# Altium schematic sheet bmsMaster_hvpath.SchDoc
size B; SheetNumber: 5; SheetTotal: 9
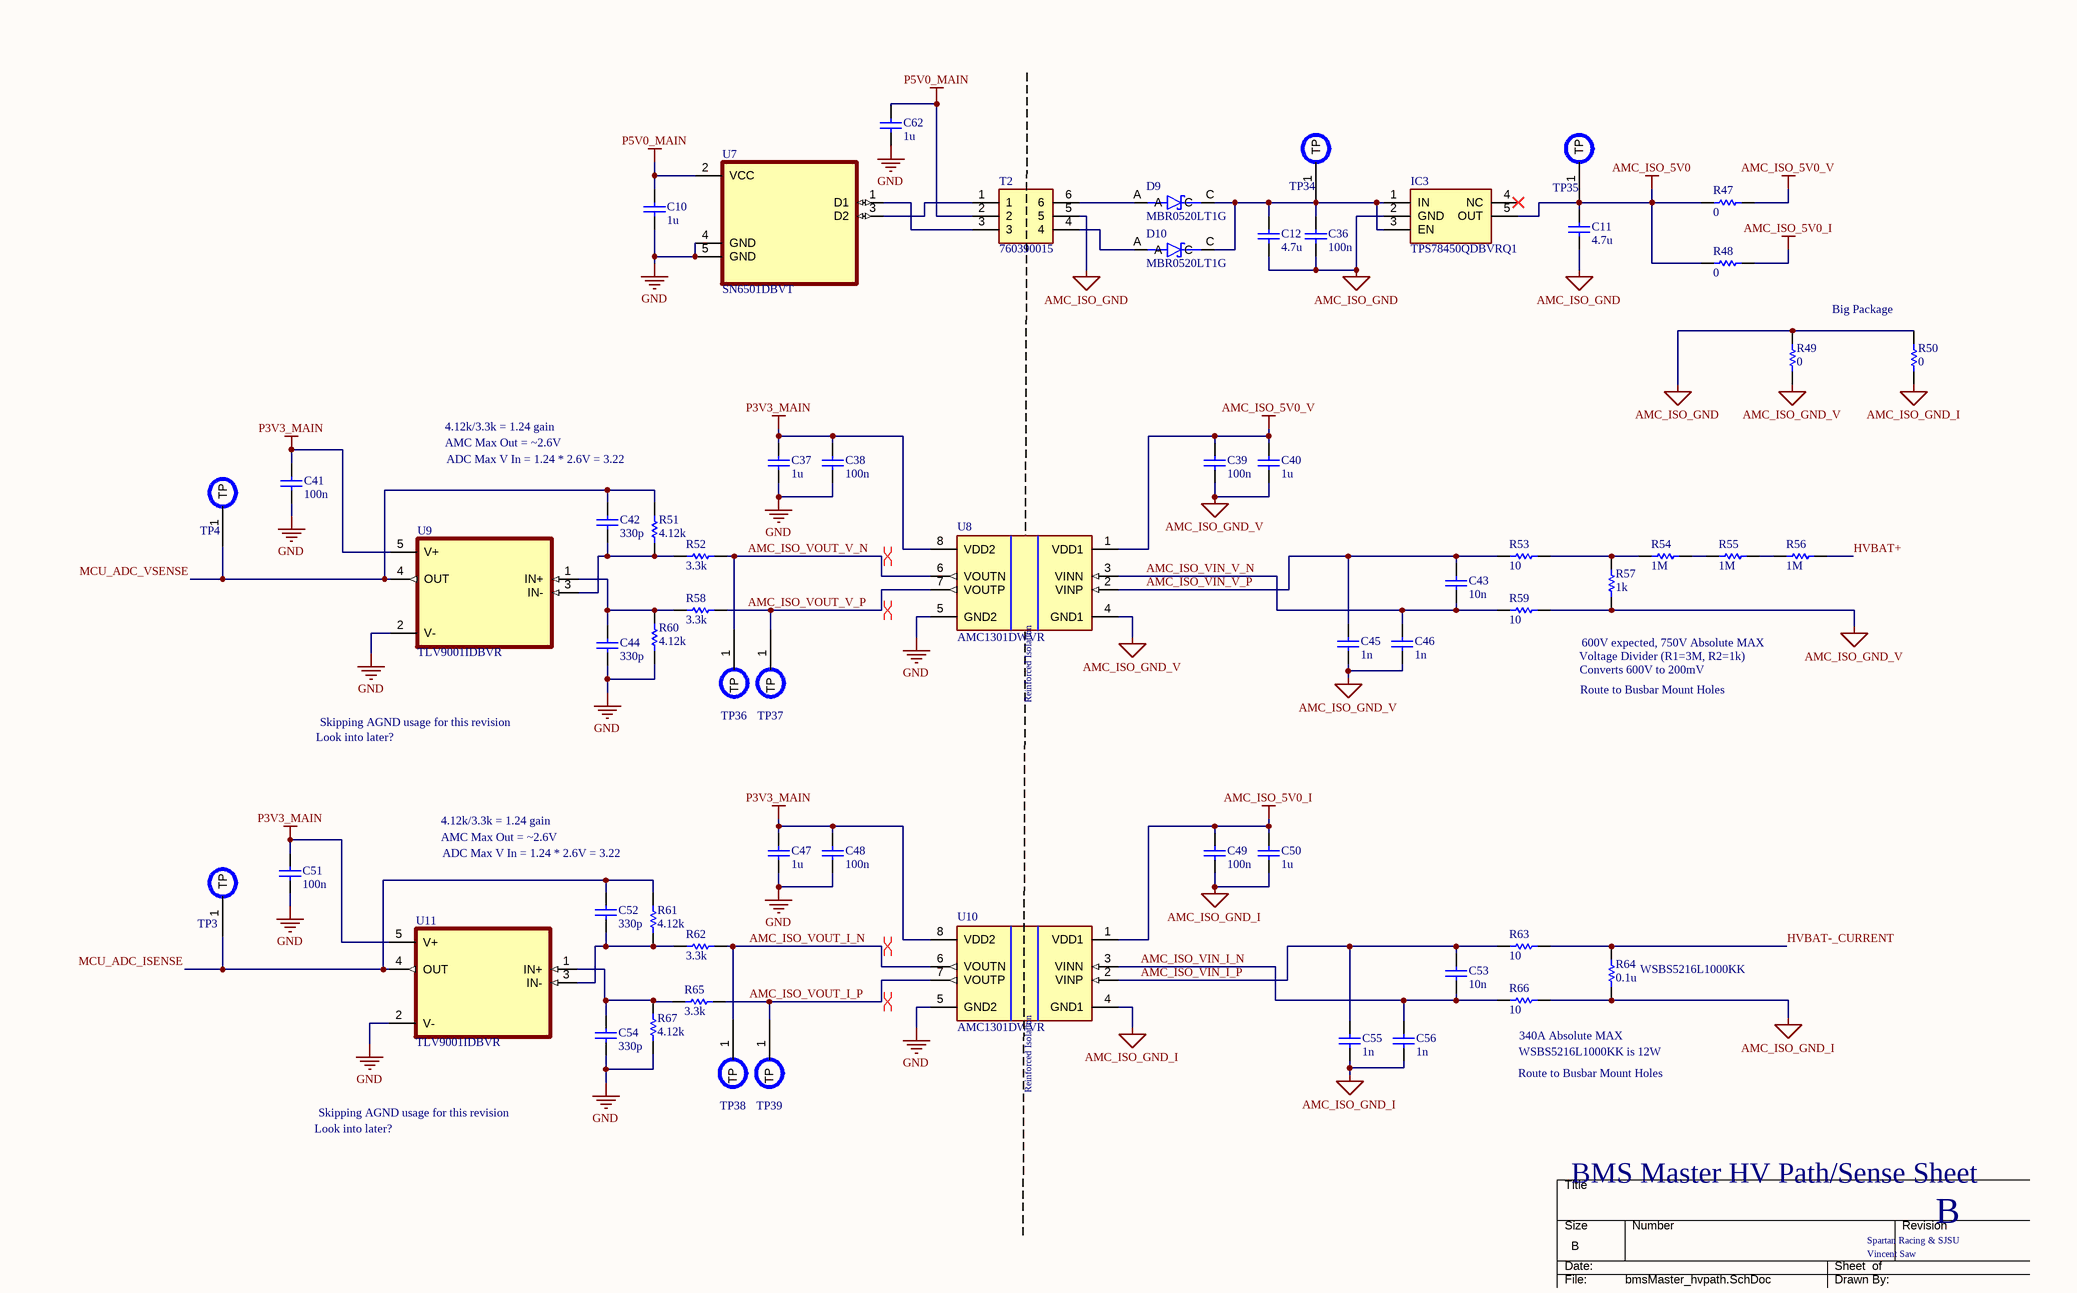
[diagram p0: bmsMaster_hvpath.SchDoc]

## Parts
C10  value 1u  [CAPC1608X90N]  (hidden comment: Capacitor)
C11  value 4.7u  [CAPC1608X90N]  (hidden comment: Capacitor)
C12  value 4.7u  [CAPC1608X90N]  (hidden comment: Capacitor)
C36  value 100n  [CAPC1608X90N]  (hidden comment: Capacitor)
C37  value 1u  [CAPC1608X90N]  (hidden comment: Capacitor)
C38  value 100n  [CAPC1608X90N]  (hidden comment: Capacitor)
C39  value 100n  [CAPC1608X90N]  (hidden comment: Capacitor)
C40  value 1u  [CAPC1608X90N]  (hidden comment: Capacitor)
C41  value 100n  [CAPC1608X90N]  (hidden comment: Capacitor)
C42  value 330p  [CAPC1608X90N]  (hidden comment: Capacitor)
C43  value 10n  [CAPC1608X90N]  (hidden comment: Capacitor)
C44  value 330p  [CAPC1608X90N]  (hidden comment: Capacitor)
C45  value 1n  [CAPC1608X90N]  (hidden comment: Capacitor)
C46  value 1n  [CAPC1608X90N]  (hidden comment: Capacitor)
C47  value 1u  [CAPC1608X90N]  (hidden comment: Capacitor)
C48  value 100n  [CAPC1608X90N]  (hidden comment: Capacitor)
C49  value 100n  [CAPC1608X90N]  (hidden comment: Capacitor)
C50  value 1u  [CAPC1608X90N]  (hidden comment: Capacitor)
C51  value 100n  [CAPC1608X90N]  (hidden comment: Capacitor)
C52  value 330p  [CAPC1608X90N]  (hidden comment: Capacitor)
C53  value 10n  [CAPC1608X90N]  (hidden comment: Capacitor)
C54  value 330p  [CAPC1608X90N]  (hidden comment: Capacitor)
C55  value 1n  [CAPC1608X90N]  (hidden comment: Capacitor)
C56  value 1n  [CAPC1608X90N]  (hidden comment: Capacitor)
C62  value 1u  [CAPC1608X90N]  (hidden comment: Capacitor)
D9  MBR0520LT1G  [SOD3716X135N]
D10  MBR0520LT1G  [SOD3716X135N]
IC3  TPS78450QDBVRQ1  [SOT95P280X145-5N]
R47  value 0  [RESC1608X50N]  (hidden comment: Resistor)
R48  value 0  [RESC1608X50N]  (hidden comment: Resistor)
R49  value 0  [RESC1608X50N]  (hidden comment: Resistor)
R50  value 0  [RESC1608X50N]  (hidden comment: Resistor)
R51  value 4.12k  [RESC1608X50N]  (hidden comment: Resistor)
R52  value 3.3k  [RESC1608X50N]  (hidden comment: Resistor)
R53  value 10  [RESC1608X50N]  (hidden comment: Resistor)
R54  value 1M  [RESC1608X50N]  (hidden comment: Resistor)
R55  value 1M  [RESC1608X50N]  (hidden comment: Resistor)
R56  value 1M  [RESC1608X50N]  (hidden comment: Resistor)
R57  value 1k  [RESC1608X50N]  (hidden comment: Resistor)
R58  value 3.3k  [RESC1608X50N]  (hidden comment: Resistor)
R59  value 10  [RESC1608X50N]  (hidden comment: Resistor)
R60  value 4.12k  [RESC1608X50N]  (hidden comment: Resistor)
R61  value 4.12k  [RESC1608X50N]  (hidden comment: Resistor)
R62  value 3.3k  [RESC1608X50N]  (hidden comment: Resistor)
R63  value 10  [RESC1608X50N]  (hidden comment: Resistor)
R64  WSBS5216L1000KK  value 0.1u  [RESC1608X50N]
R65  value 3.3k  [RESC1608X50N]  (hidden comment: Resistor)
R66  value 10  [RESC1608X50N]  (hidden comment: Resistor)
R67  value 4.12k  [RESC1608X50N]  (hidden comment: Resistor)
T2  760390015  [760390015]
TP3  TSTPT  [Testpoint1]  (value not drawn)  (no BOM)
TP4  TSTPT  [Testpoint1]  (value not drawn)  (no BOM)
TP34  TSTPT  [Testpoint1]  (value not drawn)  (no BOM)
TP35  TSTPT  [Testpoint1]  (value not drawn)  (no BOM)
TP36  TSTPT  [Testpoint1]  (value not drawn)  (no BOM)
TP37  TSTPT  [Testpoint1]  (value not drawn)  (no BOM)
TP38  TSTPT  [Testpoint1]  (value not drawn)  (no BOM)
TP39  TSTPT  [Testpoint1]  (value not drawn)  (no BOM)
U7  SN6501DBVT  [SOT95P280X145-5N]
U8  AMC1301DWVR  [SOIC127P1150X280-8N]
U9  TLV9001IDBVR  [SOT95P280X145-5N]
U10  AMC1301DWVR  [SOIC127P1150X280-8N]
U11  TLV9001IDBVR  [SOT95P280X145-5N]

## Nets
AMC_ISO_5V0: C11.2 IC3.5(OUT) R47.1 R48.1 TP35.1(TP)
AMC_ISO_5V0_I: C49.2 C50.2 R48.2 U10.1(VDD1)
AMC_ISO_5V0_V: C39.2 C40.2 R47.2 U8.1(VDD1)
AMC_ISO_GND: C11.1 C12.1 C36.1 IC3.2(GND) R49.2 R50.2 T2.5
AMC_ISO_GND_I: C49.1 C50.1 C55.1 C56.1 R50.1 R64.1 R66.1 U10.4(GND1)
AMC_ISO_GND_V: C39.1 C40.1 C45.1 C46.1 R49.1 R57.1 R59.1 U8.4(GND1)
GND: C10.1 C37.1 C38.1 C41.1 C44.1 C47.1 C48.1 C51.1 C54.1 C62.1 R60.2 R67.2 U7.4(GND) U7.5(GND) U8.5(GND2) U9.2(V-) U10.5(GND2) U11.2(V-)
P3V3_MAIN: C37.2 C38.2 C41.2 C47.2 C48.2 C51.2 U8.8(VDD2) U9.5(V+) U10.8(VDD2) U11.5(V+)
P5V0_MAIN: C10.2 C62.2 T2.2 U7.2(VCC)
AMC_ISO_VIN_I_N: C53.1 C56.2 R66.2 U10.3(VINN)
AMC_ISO_VIN_I_P: C53.2 C55.2 R63.2 U10.2(VINP)
AMC_ISO_VIN_V_N: C43.1 C46.2 R59.2 U8.3(VINN)
AMC_ISO_VIN_V_P: C43.2 C45.2 R53.2 U8.2(VINP)
AMC_ISO_VOUT_I_N: R62.1 TP38.1(TP) U10.6(VOUTN)
AMC_ISO_VOUT_I_P: R65.1 TP39.1(TP) U10.7(VOUTP)
AMC_ISO_VOUT_V_N: R52.1 TP36.1(TP) U8.6(VOUTN)
AMC_ISO_VOUT_V_P: R58.1 TP37.1(TP) U8.7(VOUTP)
HVBAT+: R56.1
HVBAT-_CURRENT: R63.1 R64.2
MCU_ADC_ISENSE: C52.2 R61.1 TP3.1(TP) U11.4(OUT)
MCU_ADC_VSENSE: C42.2 R51.1 TP4.1(TP) U9.4(OUT)
NetC12_2: C12.2 C36.2 D9.C D10.C IC3.1(IN) IC3.3(EN) TP34.1(TP)
NetC42_1: C42.1 R51.2 R52.2 U9.3(IN-)
NetC44_2: C44.2 R58.2 R60.1 U9.1(IN+)
NetC52_1: C52.1 R61.2 R62.2 U11.3(IN-)
NetC54_2: C54.2 R65.2 R67.1 U11.1(IN+)
NetD9_A: D9.A T2.6
NetD10_A: D10.A T2.4
NetR53_1: R53.1 R54.2 R57.2
NetR54_1: R54.1 R55.2
NetR55_1: R55.1 R56.2
NetT2_1: T2.1 U7.3(D2)
NetT2_3: T2.3 U7.1(D1)

Not connected (* = marked no-connect by the designer): IC3 4(NC)*

## Layout directives
differential pair: AMC_ISO_VOUT_I_N, AMC_ISO_VOUT_I_P, AMC_ISO_VOUT_V_N, AMC_ISO_VOUT_V_P

## Notes on the sheet
- Big Package
- 4.12k/3.3k = 1.24 gain
- AMC Max Out = ~2.6V
- ADC Max V In = 1.24 * 2.6V = 3.22
- Converts 600V to 200mV
- Route to Busbar Mount Holes
- Voltage Divider (R1=3M, R2=1k)
- 600V expected, 750V Absolute MAX
- Look into later?
- Skipping AGND usage for this revision
- 340A Absolute MAX
- WSBS5216L1000KK is 12W
- BMS Master HV Path/Sense Sheet
- Spartan Racing & SJSU
- B
- Vincent Saw
- DWG. NO.
- REV.
- SHT.
- THIS DOCUMENT AND THE DATA DISCLOSED HEREIN OR HEREWITH IS THE PROPERTY OF ALTIUM LIMITED AND MAY BE FREELY DISTRIBUTED IN WHOLE. NO RIGHTS ARE RESERVED OR EXPRESS OR IMPLIED WARANTEE GIVEN.
- REVISION
- DESCRIPTION
- DATE
- APPROVED
- ENG:
- APPROVALS
- PROJECT
- DSN:
- CHK:
- REFERENCE DOCUMENTS
- PROJECT REVISION:
- TITLE
- DOCUMENT REVISION:
- DESIGN ITEM:
- BOM:
- FAB DWG:
- PCB DWG:
- ASSY DWG:
- SCALE:
- SIZE
- CAGE CODE
- FILE NAME
- DWG NO.
- SHEET
- OF
- REV
- (in symbol AMC1301DWVR) Reinforced Isolation

## Library data of the parts
C10-C12 C36-C56 C62 = Capacitor: SimulationGenericComponent: True
D9 D10 = MBR0520LT1G: Rectifier, Schottky Power; Plastic Sod-123; 0.5 a @ +90c If; +125; 20v; 1000; MF: {'manufacturer': u'ON Semiconductor'}; Package: None; Price: None; Value: *; MP: MBR0520LT1G; Availability: Unavailable
IC3 = TPS78450QDBVRQ1: Integrated Circuit; Manufacturer_Name: Texas Instruments; Datasheet Link: https://www.ti.com/lit/ds/symlink/tps784-q1.pdf?ts=1621597556803&ref_url=https%253A%252F%252Fwww.ti.com%252Fstore%252Fti%252Fen%252Fp%252Fproduct%252F%253Fp%253DTPS78401QDBVRQ1; Height: 1.45mm; Manufacturer_Part_Number: TPS78450QDBVRQ1; Mouser Part Number: 595-TPS78450QDBVRQ1; Mouser Price/Stock: https://www.mouser.co.uk/ProductDetail/Texas-Instruments/TPS78450QDBVRQ1?qs=OlC7AqGiEDlNiKKFTXJdtA%3D%3D
R47-R50 = Resistor: SimulationGenericComponent: True; TC1: 0; TC2: 0
R51-R53 R58-R67 = Resistor: TC1: 0; SimulationGenericComponent: True; TC2: 0
R54-R57 = Resistor: WSBS5216L1000KK; TC1: 0; SimulationGenericComponent: True; TC2: 0
T2 = 760390015: Transformer; Manufacturer_Name: Wurth Elektronik; Datasheet Link: https://www.we-online.com/components/products/datasheet/760390015.pdf; Manufacturer_Part_Number: 760390015; Mouser Part Number: 710-760390015; Mouser Price/Stock: https://www.mouser.co.uk/ProductDetail/Wurth-Elektronik/760390015?qs=wElim4iM2pjOQCmk%252B8YbFA%3D%3D
TP3 TP4 TP34-TP39 = Testpoint1
U7 = SN6501DBVT: MF: {'manufacturer': u'Texas Instruments'}; Package: None; Price: None; Value: *; MP: SN6501DBVT; Availability: Unavailable
U8 U10 = AMC1301DWVR: MF: {'manufacturer': u'Texas Instruments'}; Package: None; Price: None; Value: *; MP: AMC1301DWVR; Availability: Unavailable
U9 U11 = TLV9001IDBVR: MF: {'manufacturer': u'Texas Instruments'}; Package: None; Price: None; Value: *; MP: TLV9001IDBVR; Availability: Unavailable